# Altium schematic sheet TEST_HJ-185-REV-B.SchDoc: Test Board HJ-185 REV-B
size A2; Date: 2020.11.18; Author: Artis Kirsteins; CompanyName: FFT; Organization: FFT; Address1: Tukums; Address2: Latvia; Revision: B; SheetNumber: 1; SheetTotal: 1; ID: HJ-185 Bluetooth
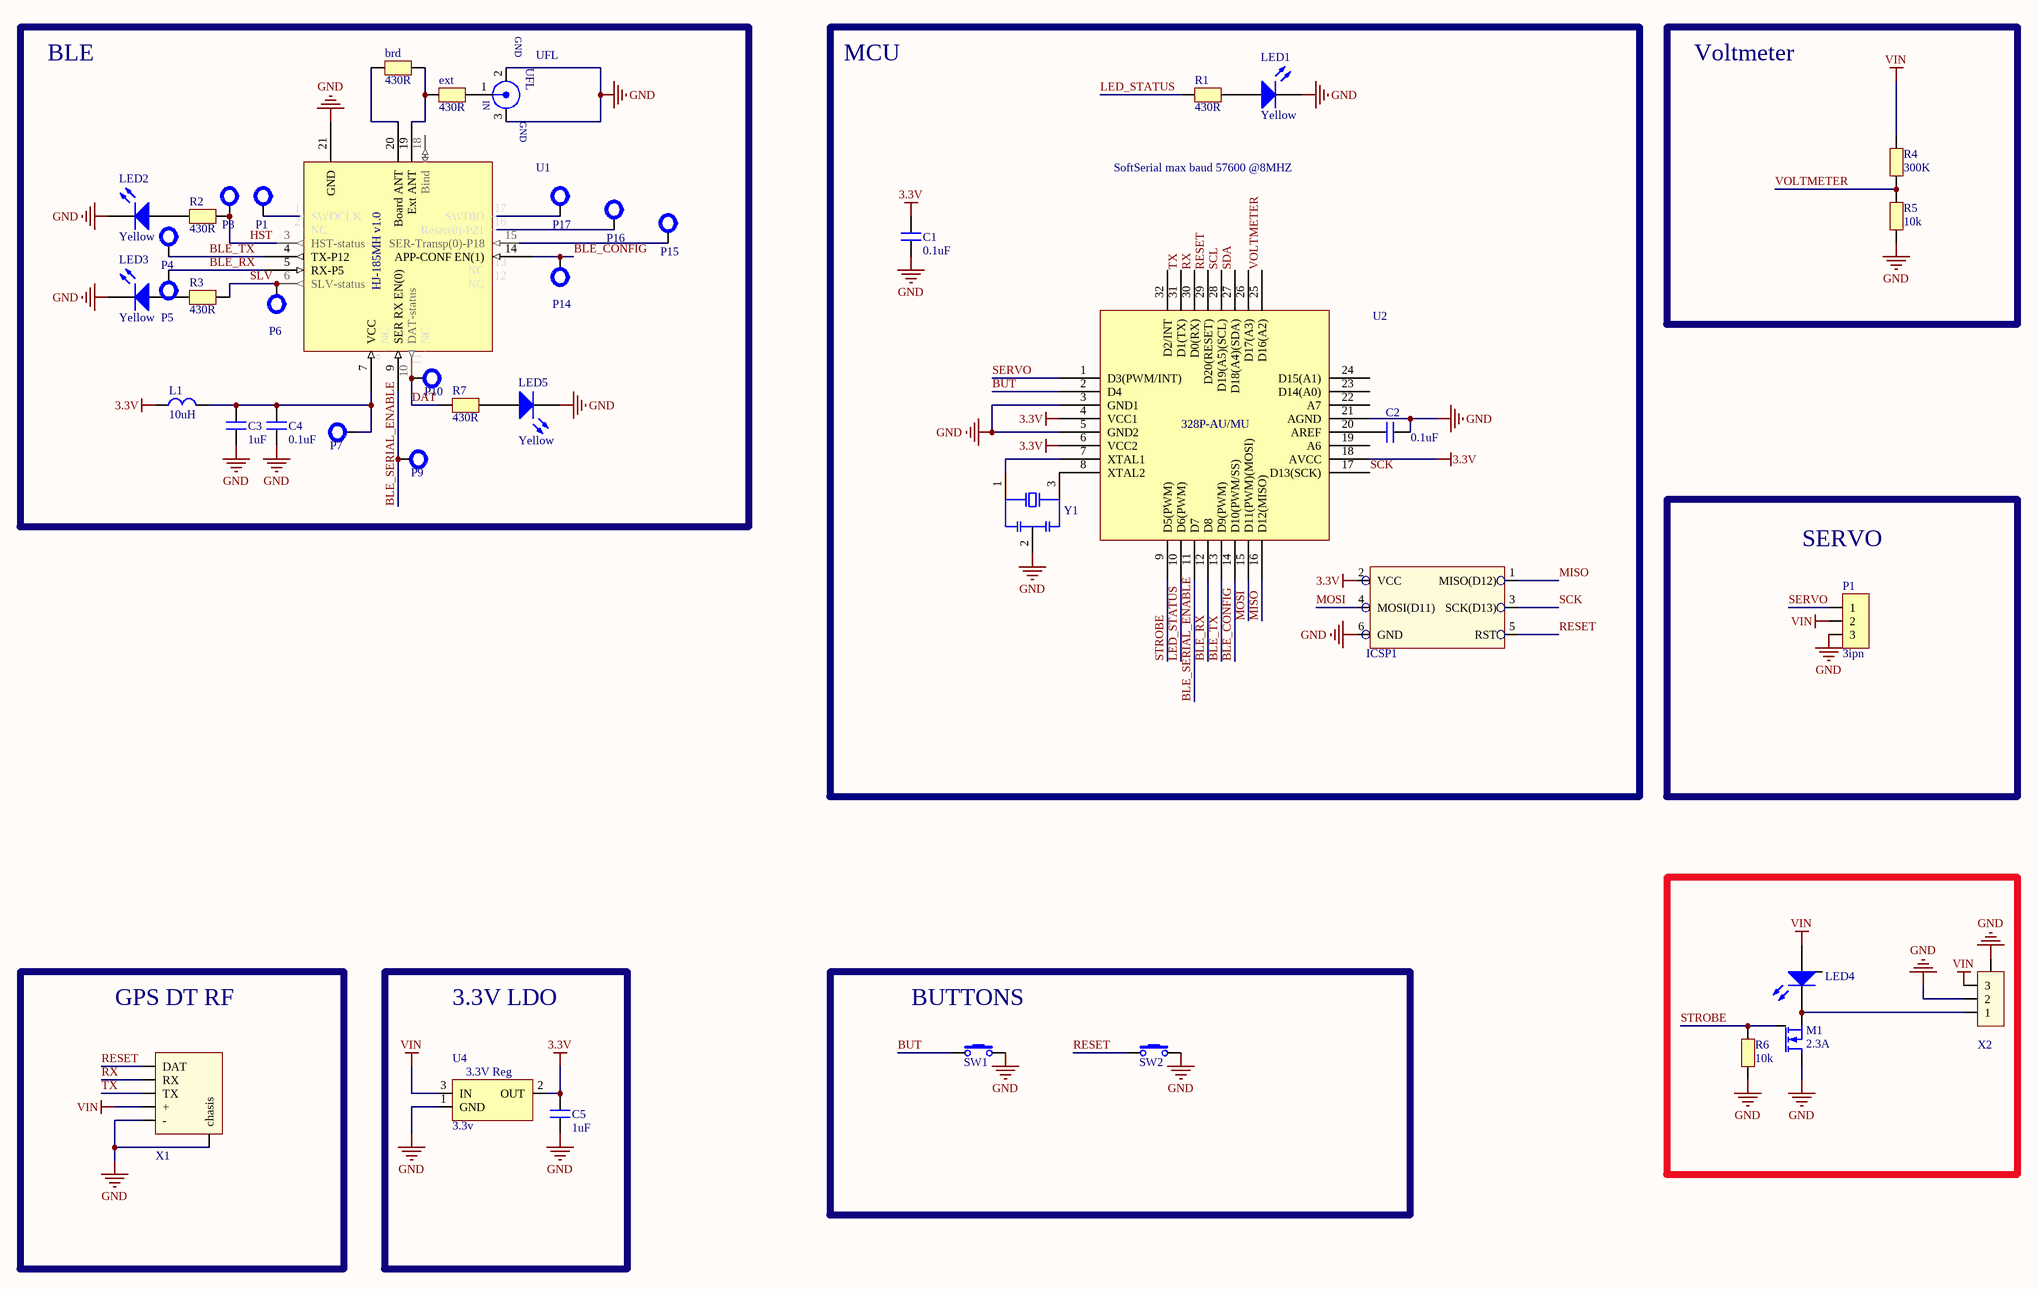
[diagram p0: TEST_HJ-185-REV-B.SchDoc]

## Parts
(Parts that share a designator on the sheet are numbered #1, #2 ... from top to bottom, then left to right.)
brd  430R  [R0603-FFT]
C1  0.1uF  [C0603-FFT]
C2  0.1uF  [C0603-FFT]
C3  1uF  [C0603-FFT]
C4  0.1uF  [C0603-FFT]
C5  1uF  [C0603-FFT]
ext  430R  [R0603-FFT]
ICSP1  Progr ICSP  [ICSP prg PIN 2.54mm]  (value not drawn)  (no BOM)
L1  10uH  [L0603]
LED1  Yellow  [LED0603]
LED2  Yellow  [LED0603]
LED3  Yellow  [LED0603]
LED4  Cool White  [CREE XPL]  (value not drawn)
LED5  Yellow  [LED0603]
M1  2.3A  [SOT23-3]
P1#1  ?  [Test Point]  (value not drawn)  (no BOM)
P1#2  3ipn  [HDR1x3]
P3  ?  [Test Point]  (value not drawn)  (no BOM)
P4  ?  [Test Point]  (value not drawn)  (no BOM)
P5  ?  [Test Point]  (value not drawn)  (no BOM)
P6  ?  [Test Point]  (value not drawn)  (no BOM)
P7  ?  [Test Point]  (value not drawn)  (no BOM)
P9  ?  [Test Point]  (value not drawn)  (no BOM)
P10  ?  [Test Point]  (value not drawn)  (no BOM)
P14  ?  [Test Point]  (value not drawn)  (no BOM)
P15  ?  [Test Point]  (value not drawn)  (no BOM)
P16  ?  [Test Point]  (value not drawn)  (no BOM)
P17  ?  [Test Point]  (value not drawn)  (no BOM)
R1  430R  [R0603-FFT]
R2  430R  [R0603-FFT]
R3  430R  [R0603-FFT]
R4  300K  [R0603-FFT]
R5  10k  [R0603-FFT]
R6  10k  [R0603-FFT]
R7  430R  [R0603-FFT]
SW1  (no value)  [Switch Tactile SKRPACE010]
SW2  (no value)  [Switch Tactile TS-1088C]
U1  BLE 5.1  [LGA-24-fft]  (value not drawn)
U2  (no value)  [32-pin QFP 10mm]
U4  3.3v  [SOT23-3]
UFL  UFL-simple  [UFL]  (value not drawn)
X1  1.0mm 5pin  [JST 5pin 1mm]  (value not drawn)
X2  1.0mm 3pin  [JST 3pin 1mm]  (value not drawn)
Y1  CSTCE8M0V53-R0  [OSC_CSTCE16M0V53-R0]  (value not drawn)

## Blocks framed on the sheet
BLE: brd C3 C4 ext L1 LED2 LED3 LED5 P1#1 P3-P7 P9 P10 P14-P17 R2 R3 R7 U1 UFL
MCU: C1 C2 ICSP1 LED1 R1 U2 Y1
Voltmeter: R4 R5
SERVO: P1#2
GPS DT RF: X1
3.3V LDO: C5 U4
BUTTONS: SW1 SW2

## Nets
3.3V: C1.2 C5.2 ICSP1.2(VCC) L1.1 U2.4(VCC1) U2.6(VCC2) U2.18(AVCC) U4.2(OUT)
GND: C1.1 C2.2 C3.1 C4.1 C5.1 ICSP1.6(GND) LED1.C LED2.C LED3.C LED5.C M1.3(D) P1#2.3 R5.1 R6.1 SW1.2 SW2.2 U1.21(GND) U2.3(GND1) U2.5(GND2) U2.21(AGND) U4.1(GND) UFL.2(OUT) UFL.3(GND) X1.5(-) X1.6(chasis) X2.2 X2.6(GND) Y1.2(OSC2)
VIN: LED4.A P1#2.2 R4.2 U4.3(IN) X1.4(+) X2.3
BLE_CONFIG: P14.1 U1.14(APP-CONF_EN(1)) U2.14(D10(PWM/SS))
BLE_RX: P5.1 U1.5(RX-P5) U2.12(D8)
BLE_SERIAL_ENABLE: P9.1 U1.9(SER_RX_EN(0)) U2.11(D7)
BLE_TX: P4.1 U1.4(TX-P12) U2.13(D9(PWM))
BUT: SW1.1 U2.2(D4)
DAT: P10.1 R7.1 U1.10(DAT-status)
HST: P3.1 R2.1 U1.3(HST-status)
LED_STATUS: R1.1 U2.10(D6(PWM))
MISO: ICSP1.1(MISO(D12)) U2.16(D12(MISO))
MOSI: ICSP1.4(MOSI(D11)) U2.15(D11(PWM)(MOSI))
RESET: ICSP1.5(RST) SW2.1 U2.29(D20(RESET)) X1.1(DAT)
RX: U2.30(D0(RX)) X1.2(RX)
SCK: ICSP1.3(SCK(D13)) U2.17(D13(SCK))
SCL: U2.28(D19(A5)(SCL))
SDA: U2.27(D18(A4)(SDA))
SERVO: P1#2.1 U2.1(D3(PWM/INT))
SLV: P6.1 R3.1 U1.6(SLV-status)
STROBE: M1.1(G) R6.2 U2.9(D5(PWM))
TX: U2.31(D1(TX)) X1.3(TX)
VOLTMETER: R4.1 R5.2 U2.25(D16(A2))
Netbrd_1: brd.1 U1.20(Board_ANT)
Netbrd_2: brd.2 ext.1 U1.19(Ext_ANT)
NetC2_1: C2.1 U2.20(AREF)
NetC3_2: C3.2 C4.2 L1.2 P7.1 U1.7(VCC)
Netext_2: ext.2 UFL.1(ANT)
NetLED1_A: LED1.A R1.2
NetLED2_A: LED2.A R2.2
NetLED3_A: LED3.A R3.2
NetLED4_K: LED4.K M1.2(S) X2.1
NetLED5_A: LED5.A R7.2
NetP1#1_1: P1#1.1 U1.1(SWDCLK)
NetP15_1: P15.1 U1.15(SER-Transp(0)-P18)
NetP16_1: P16.1 U1.16(Reset(0)-P21)
NetP17_1: P17.1 U1.17(SWDIO)
NetU2_7: U2.7(XTAL1) Y1.1(OSC1)
NetU2_8: U2.8(XTAL2) Y1.3(OSC3)

Not connected (* = marked no-connect by the designer): LED4 PAD(P); U1 2(NC) 8(NC) 11(NC) 12(NC) 13(NC) 18(Bind); U2 19(A6) 22(A7) 23(D14(A0)) 24(D15(A1)) 26(D17(A3)) 32(D2/INT)

## Notes on the sheet
- SoftSerial max baud 57600 @8MHZ
- Title
- Size:
- Date:
- File:
- A2
- Number:
- Time:
- Revision:
- Sheet
- of
- (in symbol AP2210N-3.3TRG1) 3.3V Reg
- (in symbol Atmega 328P-AU) 328P-AU/MU
- (in symbol HJ-185MH) HJ-185MH v1.0
- (in symbol UFL - simple) IN

## Library data of the parts
brd ext = R0603_430: Resistor 0603; Part Number: 0603WAF4300T5E; Manufacturer: Uniroyal Elec; Part Description: RES 430R ±1% 0.1W -55÷155°C 0603; PartFootprint: 0603; Percent: ±1%; Wattage: 0.1W; Value: 430R; Temperature: -55÷155°C; Price: 0,002; LCSC Part #: C23170
C1 C2 C4 = C0603_0.1uF_50V: Part Number: CC0603KRX7R9BB104; Part Description: CAP 0.1uF ±10% 50V X7R -55÷125°C 0603; Manufacturer: YAEGO; PartFootprint: 0603; Value2: 104; Percent: ±10%; Voltage: 50V; Dielectric: X7R; Name: CAP; Packing: Tape; Value: 0.1uF; Temperature: -55÷125°C; Price: 0.005; LCSC Part #: C14663
C3 C5 = C0603_1uF_25V: Part Number: CL10A105KB8NNNC; Part Description: CAP 1uF ±10% 25V X5R -55÷85°C 0603; Manufacturer: SAMSUNG; PartFootprint: 0603; Value2: 105; Percent: ±10%; Voltage: 25V; Dielectric: X5R; Name: CAP; Packing: Tape; Value: 1uF; Temperature: -55÷85°C; Price: 0.01; LCSC Part #: C15849
ICSP1 = Progr ICSP: PAD prog
L1 = L0603_10uH: Inductor; Part Number: 222; Part Description: SMD Inductor 0603; Manufacturer: Aliexpress; Part Footprint: 0603; Percent: ±10%; Value: 10uH; Price: 0.2
LED1-LED3 LED5 = 19-213/Y2C-CQ2R2L/3T(CY): LED 0603 chip; Manufacturer: Everlight Elec; Part Description: YEL LED 0603; Part Footprint: 0603; Part Number: 19-213/Y2C-CQ2R2L/3T(CY); Value: Yellow; Price: 0.01; LCSC Part #: C72038
LED4 = XPL: LED; Manufacturer: CREE; Part Description: High power LED chip 3A; Part Footprint: SMD; Part Number: XPL; Value: Cool White; Price: 2
M1 = IRLML0030: MOSFET N-Channel; Manufacturer: IR; Part Footprint: SOT-23; Part Description: ='N-MOSFET 30V 2.7A '+Temperature+' '+PartFootprint; Part Number: IRLML0030; Value: 2.3A; Price: 0,2
P1#1 P3-P7 P9 P10 P14-P17 = Test Point: Part Number: C0402; PartFootprint: 0402; Percent: ±10%; Value: ?; Part Description: =Name+' '+Value+' '+Percent+' '+Voltage+' '+Dielectric+' '+Temperature+' '+PartFootprint; Manufacturer: ?
P1#2 = Header 3x1: Header 3x1-PIN, 2.54mm; Manufacturer: Connfly; Part Description: 1x3 IDC male header; Part Footprint: THT; Part Number: DS1021-1*3SF1-1; Value: 3pin; Price: 0.1
R1-R3 R7 = R0603_430: SMD resistor; Part Number: 0603WAF4300T5E; Manufacturer: Uniroyal Elec; Part Description: RES 430R ±1% 0.1W -55÷155°C 0603; PartFootprint: 0603; Percent: ±1%; Wattage: 0.1W; Value: 430R; Value2: 430R; Temperature: -55÷155°C; Price: 0.002; LCSC Part #: C23170
R4 = R0603_300k: SMD resistor; Part Number: 0603WAF3003T5E; Manufacturer: Uniroyal Elec; Part Description: RES 300K ±1% 0.1W -55÷155°C 0603; PartFootprint: 0603; Percent: ±1%; Wattage: 0.1W; Value: 300K; Value2: 300k; Temperature: -55÷155°C; LCSC Part #: C23024; Price: 0.002
R5 R6 = R0603_10k: SMD resistor; Part Number: 0603WAF1002T5E; Manufacturer: Uniroyal Elec; Part Description: RES 10k ±1% 0.1W -55÷155°C 0603; PartFootprint: 0603; Percent: ±1%; Wattage: 0.1W; Value: 10k; Value2: 10K; Temperature: -55÷155°C; LCSC Part #: C25804; Price: 0.002
SW1 = SKRPACE010: Switch Tactile; Part Description: Tactile switch, 3.2x4.2x2.5mm 50mA; Manufacturer: ALPS; PartFootprint: SMD 3.3x4.2; Temperature: -25÷70°C; Part Number: SKRPACE010; Price: 0.07
SW2 = TS-1088C-02526: Switch Tactile; Part Description: Tactile switch, 3x4.2x2.5mm 50mA; Manufacturer: XUNPU; PartFootprint: SMD 3x4mm; Temperature: -25÷70°C; Part Number: TS-1088C-02526; Price: 0.07
U1 = HJ-185MH: Module BLE; Part Number: HJ-185IMH_SPPv2; Manufacturer: tshjdz.com; Part Footprint: LGA-24; Part Description: BLE Module 5.5x5.5mm, inbuilt antenna; Price: 4; LCSC Part #: ---; Value: BLE 5.1
U2 = Atmega 328P-AU: MCU; Manufacturer: Microchip Tech; Part Footprint: TQFP-32_7.0x7.0x0.8P; Part Number: ATmega 328p-AU; Part Description: MCU; Price: 1,3; LCSC Part #: C14877
U4 = AP2210N-3.3TRG1: LDO 3.3V 300mA; Part Footprint: SOT-23-3; Part Number: MIC5209; Manufacturer: DIODES INCORPORATED; Part Description: LDO 3.3V 0.3A; Value: 3.3v; Price: 0.08
UFL = UFL - simple: Connector UFL antenna; Manufacturer: Hirose Electric Co Ltd; Part Description: UFL connector; Part Footprint: SMD; Part Number: U.FL-R-SMT-1(10); Price: 0.1
X1 = SM05B-FFT: Connector 5p hor 1mm; Manufacturer: JST; Part Number: SM05B-SRSS-TB; Part Footprint: SMD; Part Description: 1.00 mm pitch connector; Value: 1.0mm 5pin; Price: 0,3
X2 = SM03B-SRSS-TB: Connector 3p hor 1mm; Manufacturer: JST; Part Number: SM05B-SRSS-TB; Part Footprint: SMD; Part Description: 1.00 mm pitch connector, horizontal; Value: 1.0mm 3pin; Price: 0.30
Y1 = CSTCE8M0V53-R0: Ceramic Resonator 8Mhz; Manufacturer: Murata; Part Footprint: SMD-3 Murata; Part Description: 8MHz Ceramic Resonator Built in Cap 15pF ±0.3% -20°C ~ 80°C SMD; Part Number: CSTCE8M0V53-R0_1; Price: 0.37; Value: 8MHz